# EAGLE design centraldb9 (EAGLE 6.5.0)
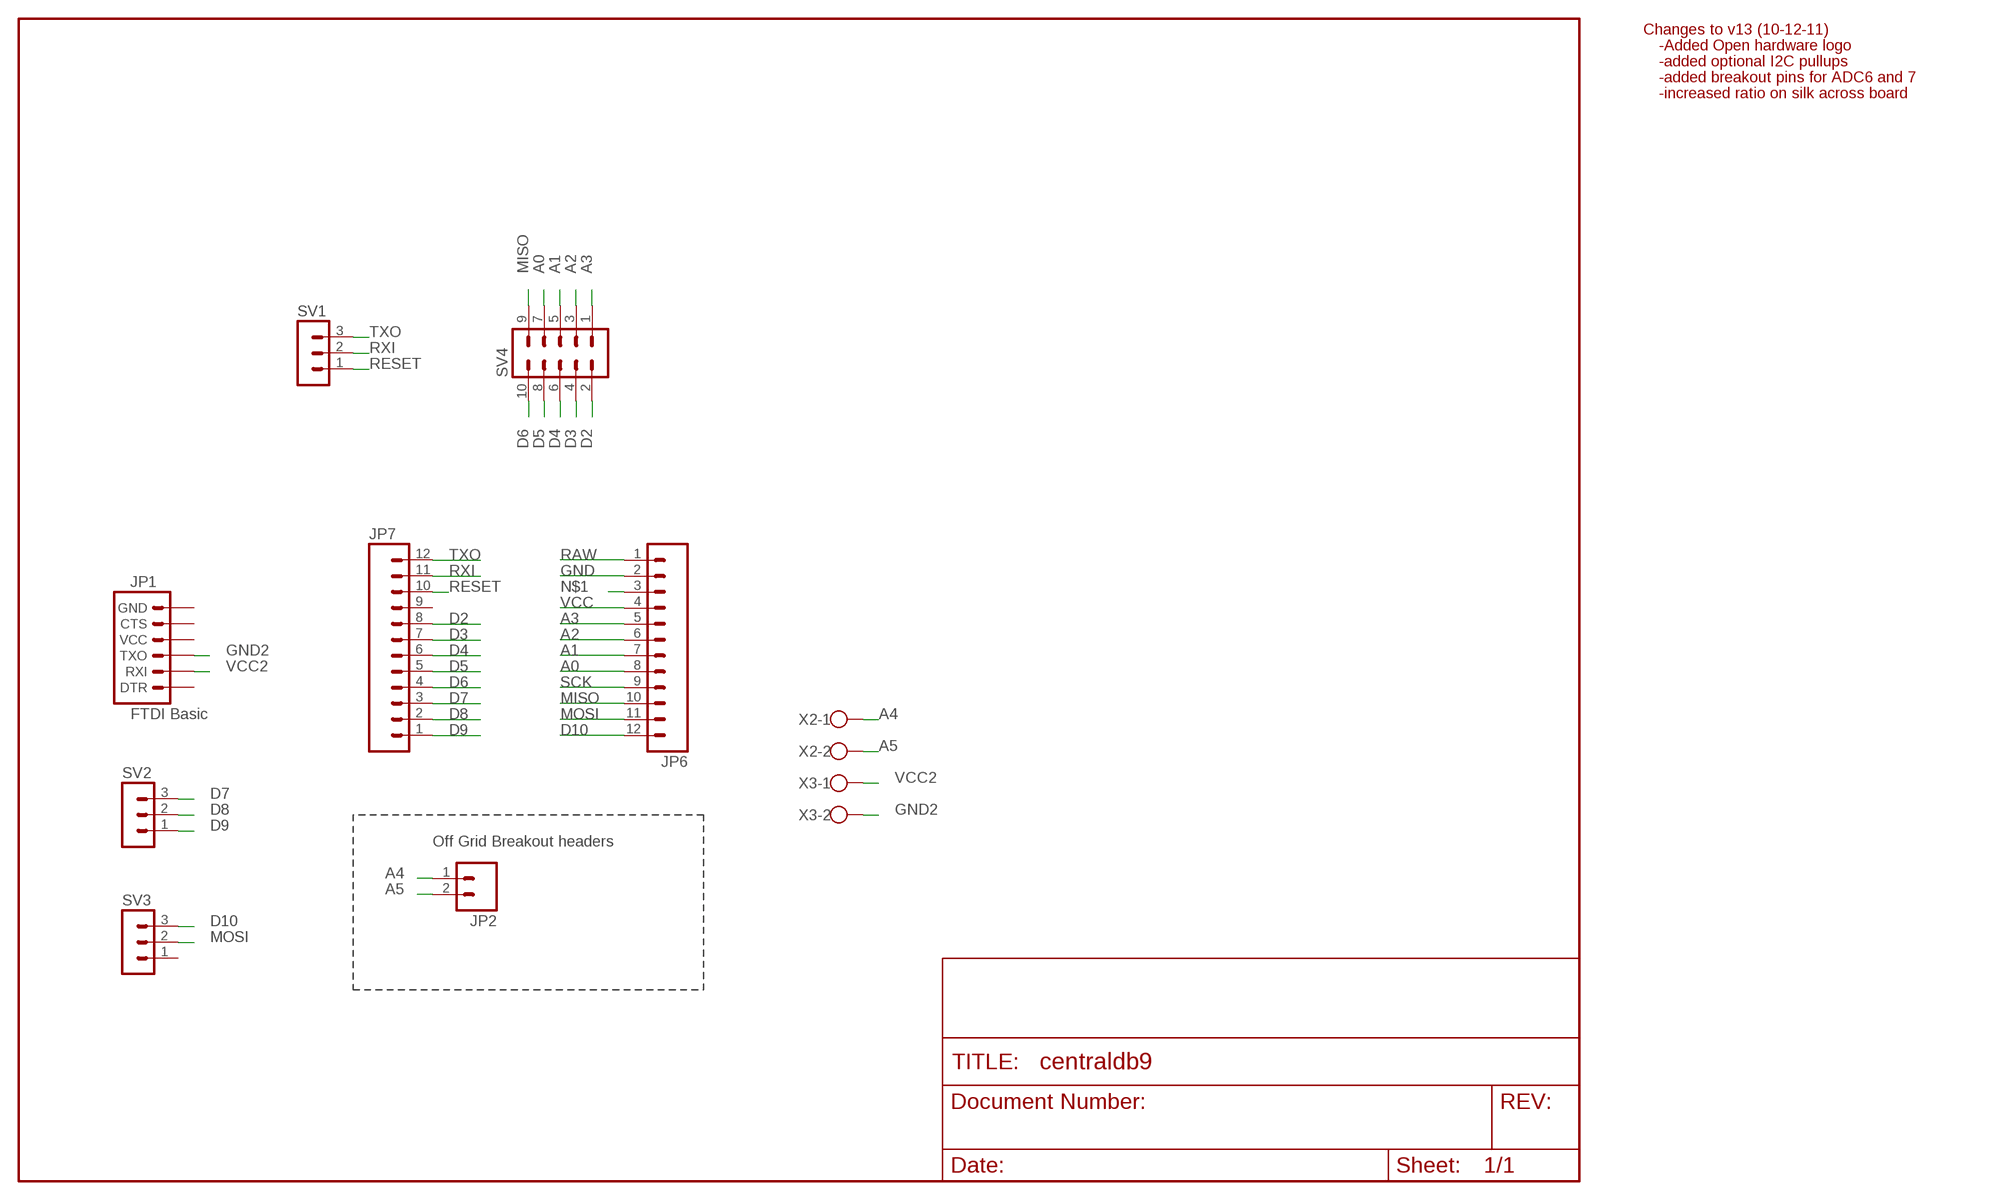
[diagram p0: schematic, sheet 1]

## Parts
JP1  FTDI Basic  ARDUINO_SERIAL_PROGRAMPTH  [1X06]
JP2  M02PTH  [1X02]
JP6  M12PTH  [1X12]
JP7  M12PTH  [1X12]
SV1  MA03-1  [MA03-1]
SV2  MA03-1  [MA03-1]
SV3  MA03-1  [MA03-1]
SV4  MA05-2  [MA05-2]
X2  W237-102  [W237-102]
X3  W237-102  [W237-102]

## Nets
A0: JP6.8 SV4.7
A1: JP6.7 SV4.5
A2: JP6.6 SV4.3
A3: JP6.5 SV4.1
A4: JP2.1 X2.1
A5: JP2.2 X2.2
D2: JP7.8 SV4.2
D3: JP7.7 SV4.4
D4: JP7.6 SV4.6
D5: JP7.5 SV4.8
D6: JP7.4 SV4.10
D7: JP7.3 SV2.3
D8: JP7.2 SV2.2
D9: JP7.1 SV2.1
D10: JP6.12 SV3.3
GND [vcc]: JP6.2
GND2 [vcc]: JP1.3(TXO) X3.2
MISO: JP6.10 SV4.9
MOSI: JP6.11 SV3.2
N$1: JP6.3
RAW [vcc]: JP6.1
RESET: JP7.10 SV1.1
RXI: JP7.11 SV1.2
SCK: JP6.9
TXO: JP7.12 SV1.3
VCC: JP6.4
VCC2: JP1.2(RXI) X3.1
Unconnected: JP1.1(DTR) JP1.4(VCC) JP1.5(CTS) JP1.6(GND) JP7.9 SV3.1

## Notes on the sheet
- Changes to v13 (10-12-11)
- -Added Open hardware logo
- -added optional I2C pullups
- -added breakout pins for ADC6 and 7
- -increased ratio on silk across board
- Off Grid Breakout headers

## Library data of the parts
JP1 = SparkFun:ARDUINO_SERIAL_PROGRAM
JP2 = SparkFun:M02: Header 2 Standard 2-pin 0.1" header. Use with straight break away headers (SKU : PRT-00116), right angle break away headers (PRT-00553), swiss pins (PRT-00743), machine pins (PRT-00117), and female headers (PRT-00115). Molex polarized connector foot print use with SKU : PRT-08233 with associated crimp pins and housings.
JP6 JP7 = SparkFun:M12: Header 12 Standard 12-pin 0.1" header. Use with straight break away headers (SKU : PRT-00116), right angle break away headers (PRT-00553), swiss pins (PRT-00743), machine pins (PRT-00117), and female headers (PRT-00115).
SV1-SV3 = con-lstb:MA03-1: PIN HEADER; OC_FARNELL: unknown; OC_NEWARK: unknown
SV4 = con-lstb:MA05-2: PIN HEADER; OC_FARNELL: unknown; OC_NEWARK: unknown
X2 X3 = con-wago-500:W237-102: WAGO SCREW CLAMP; MPN: 237-102; OC_FARNELL: unknown; OC_NEWARK: 70K9898

## Net classes
0 default: width 0.203 mm
1 vcc: width 0.254 mm

## Board
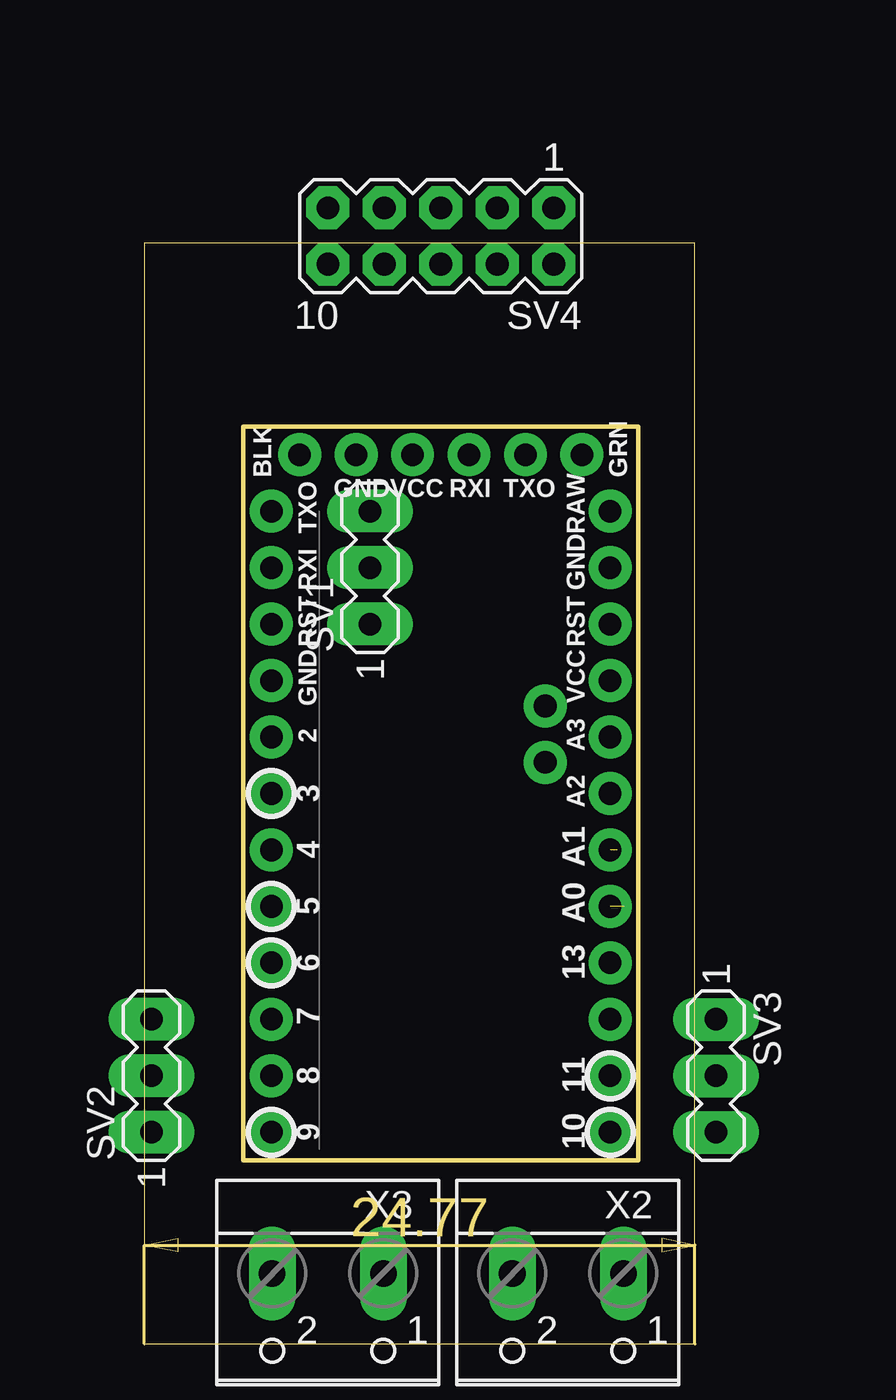
[diagram p1: board, top side]
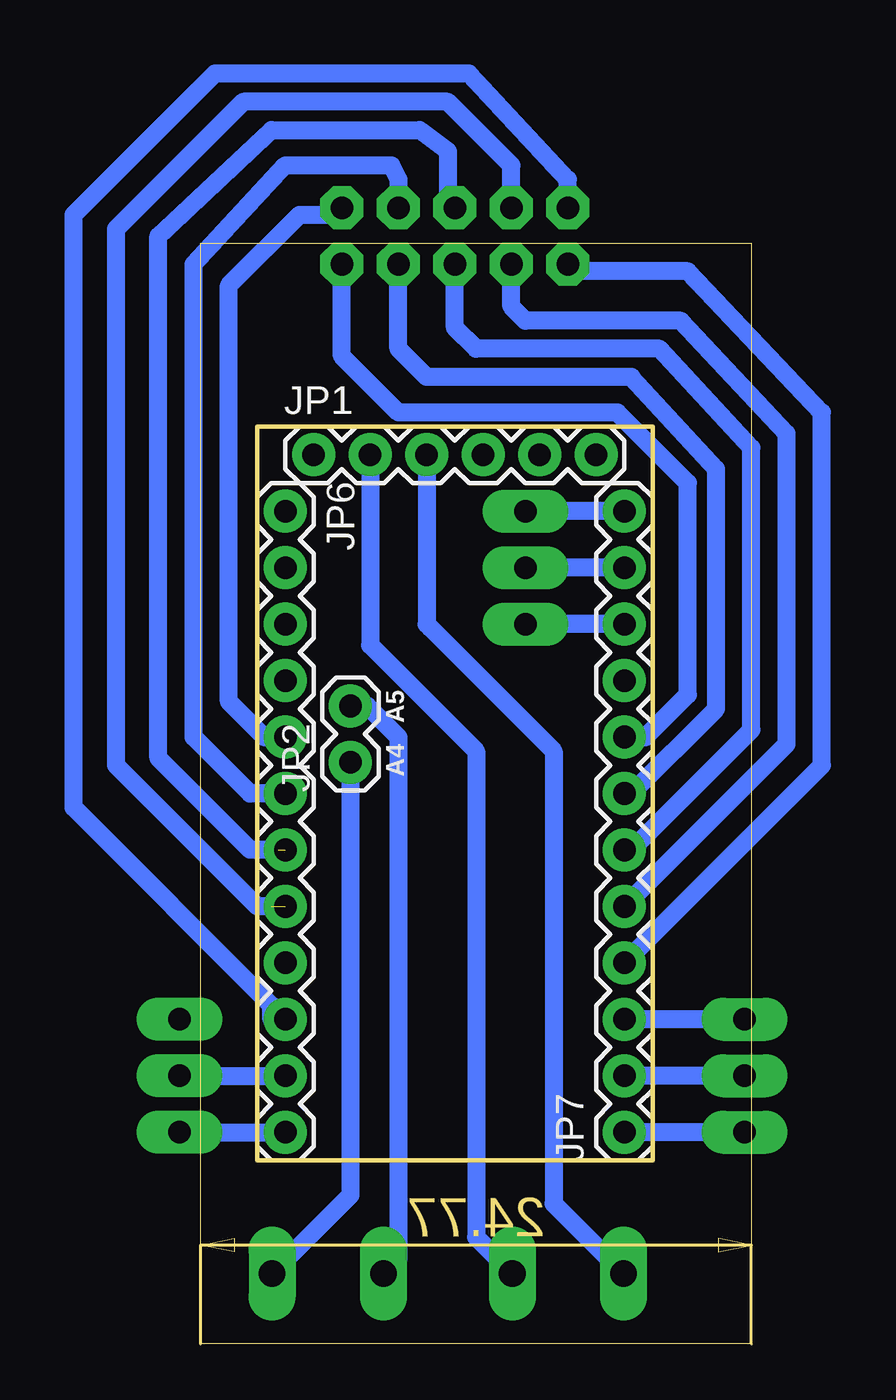
[diagram p2: board, bottom side, seen from below]

Size 24.77 x 49.53 mm. Coordinates in mm from the lower left corner, seen from the top.
Outline: 4.45,41.28 4.45,8.26 22.23,8.26 22.23,41.28 4.45,41.28
Copper layers (1*16): Top 0.035mm / dielectric 1.5mm / Bottom 0.035mm
Design rules "default *": minimum track width 8mil, minimum drill 20mil, track to track 8mil, track to pad 8mil, pad to pad 8mil, via to via 8mil, smd to smd 8mil, copper to edge 8mil, drill to drill 8mil, minimum pad ring 18mil, minimum via ring 10mil, stop-mask expansion 4mil, vias tented up to drill 20mil, thermal gap 10mil

### Footprints (pad centres in the part's own frame; a part is rotated, then mirrored left to right if it is on the bottom)
1X06 = drill 1.016 pad 1.88: 1 0,0; 2 2.54,0; 3 5.08,0; 4 7.62,0; 5 10.16,0; 6 12.7,0
1X02 = drill 1.016 pad 1.88: 1 0,0; 2 2.54,0
1X12 = drill 1.016 pad 1.88: 1 0,0; 2 2.54,0; 3 5.08,0; 4 7.62,0; 5 10.16,0; 6 12.7,0; 7 15.24,0; 8 17.78,0; 9 20.32,0; 10 22.86,0; 11 25.4,0; 12 27.94,0
MA03-1 = drill 1.016 long: 1 -2.54,0; 2 0,0; 3 2.54,0
MA05-2 = drill 1.016 octagon: 1 -5.08,-1.27; 2 -5.08,1.27; 3 -2.54,-1.27; 4 -2.54,1.27; 5 0,-1.27; 6 0,1.27; 7 2.54,-1.27; 8 2.54,1.27; 9 5.08,-1.27; 10 5.08,1.27
W237-102 = drill 1.194 long: 1 -2.5,-1.27; 2 2.5,-1.27

### Placement (x,y rotation side)
JP1  19.69,40.01 0 bottom
JP2  18.03,26.16 90 bottom
JP6  20.96,37.47 270 bottom
JP7  5.71,9.53 90 bottom
SV1  10.16,34.93 90 top
SV2  0.32,12.07 90 top
SV3  25.72,12.07 270 top
SV4  13.34,49.85 180 top
X2  19.05,1.91 180 top
X3  8.26,1.91 180 top

### Tracks (layer width: path | path; a pad name or v marks a point on that pad's centre or on a via)
A0  (1 unrouted)
  Bottom 0.813: SV4.7 10.79,53.02 13.65,55.88 22.86,55.88 28.57,50.16 28.57,26.04 22.23,19.69 21.59,19.69
A1  (1 unrouted)
  Bottom 0.813: SV4.5 13.65,51.44 13.65,53.66 14.92,54.61 21.59,54.61 26.67,49.85 26.67,26.35 22.54,22.23 21.27,22.23
A2
  Bottom 0.813: SV4.3 15.88,52.39 16.19,53.02 20.96,53.02 25.08,48.58 25.08,27.31 22.54,24.77 JP6.6
A3
  Bottom 0.813: JP6.5 21.91,27.31 23.5,28.89 23.5,47.62 20.32,50.8 18.73,50.8 SV4.1
A4
  Bottom 0.813: JP2.1 18.03,6.69 X2.1
A5
  Bottom 0.813: JP2.2 17.27,28.7 15.88,27.31 15.88,3.85 X2.2
D2
  Bottom 0.813: JP7.8 4.76,27.31 2.86,29.21 2.86,38.73 6.03,41.91 15.88,41.91 18.41,44.45 SV4.2
D3
  Bottom 0.813: JP7.7 5.4,24.77 1.59,28.58 1.59,39.37 5.4,43.5 14.61,43.5 15.88,44.77 SV4.4
D4
  Bottom 0.813: JP7.6 5.4,22.23 0,27.62 0,40.32 4.13,44.77 12.38,44.77 13.34,45.72 SV4.6
D5
  Bottom 0.813: JP7.5 -1.59,26.99 -1.59,40.96 3.18,46.04 10.16,46.04 10.79,46.67 SV4.8
D6
  Bottom 0.813: 5.71,16.83 JP7.4 -3.17,26.04 -3.17,41.91 2.86,48.26 7.94,48.26 SV4.10
D7
  Bottom 0.813: SV2.3 JP7.3
D8
  Bottom 0.813: SV2.2 JP7.2
D9
  Bottom 0.813: SV2.1 JP7.1
D10
  Bottom 0.813: SV3.3 JP6.12
GND2
  Bottom 0.813: X3.2 8.89,6.31 8.89,26.67 14.45,32.23 14.61,32.39 JP1.3
MISO
  Bottom 0.813: JP6.10 21.59,14.61 21.59,15.24 30.48,24.13 30.48,50.8 24.13,57.15 12.7,57.15 8.26,52.39 SV4.9
MOSI
  Bottom 0.813: SV3.2 JP6.11
RESET
  Bottom 0.813: JP7.10 SV1.1
RXI
  Bottom 0.813: JP7.11 SV1.2
TXO
  Bottom 0.813: JP7.12 SV1.3
VCC2
  Bottom 0.813: X3.1 12.38,4.8 12.38,26.67 17.14,31.43 JP1.2

### Text on the board
tPlace: BLK | GRN | GND | VCC | RXI | TXO | TXO | RAW | RXI | GND | RST | RST | VCC | GND | 2 | A3 | 3 | A2 | 4 | A1 | 5 | A0 | 6 | 13 | 7 | 8 | 11 | 9 | 10
bPlace: A5 | A4